# Altium project Oscilloscope_board.PrjPcb
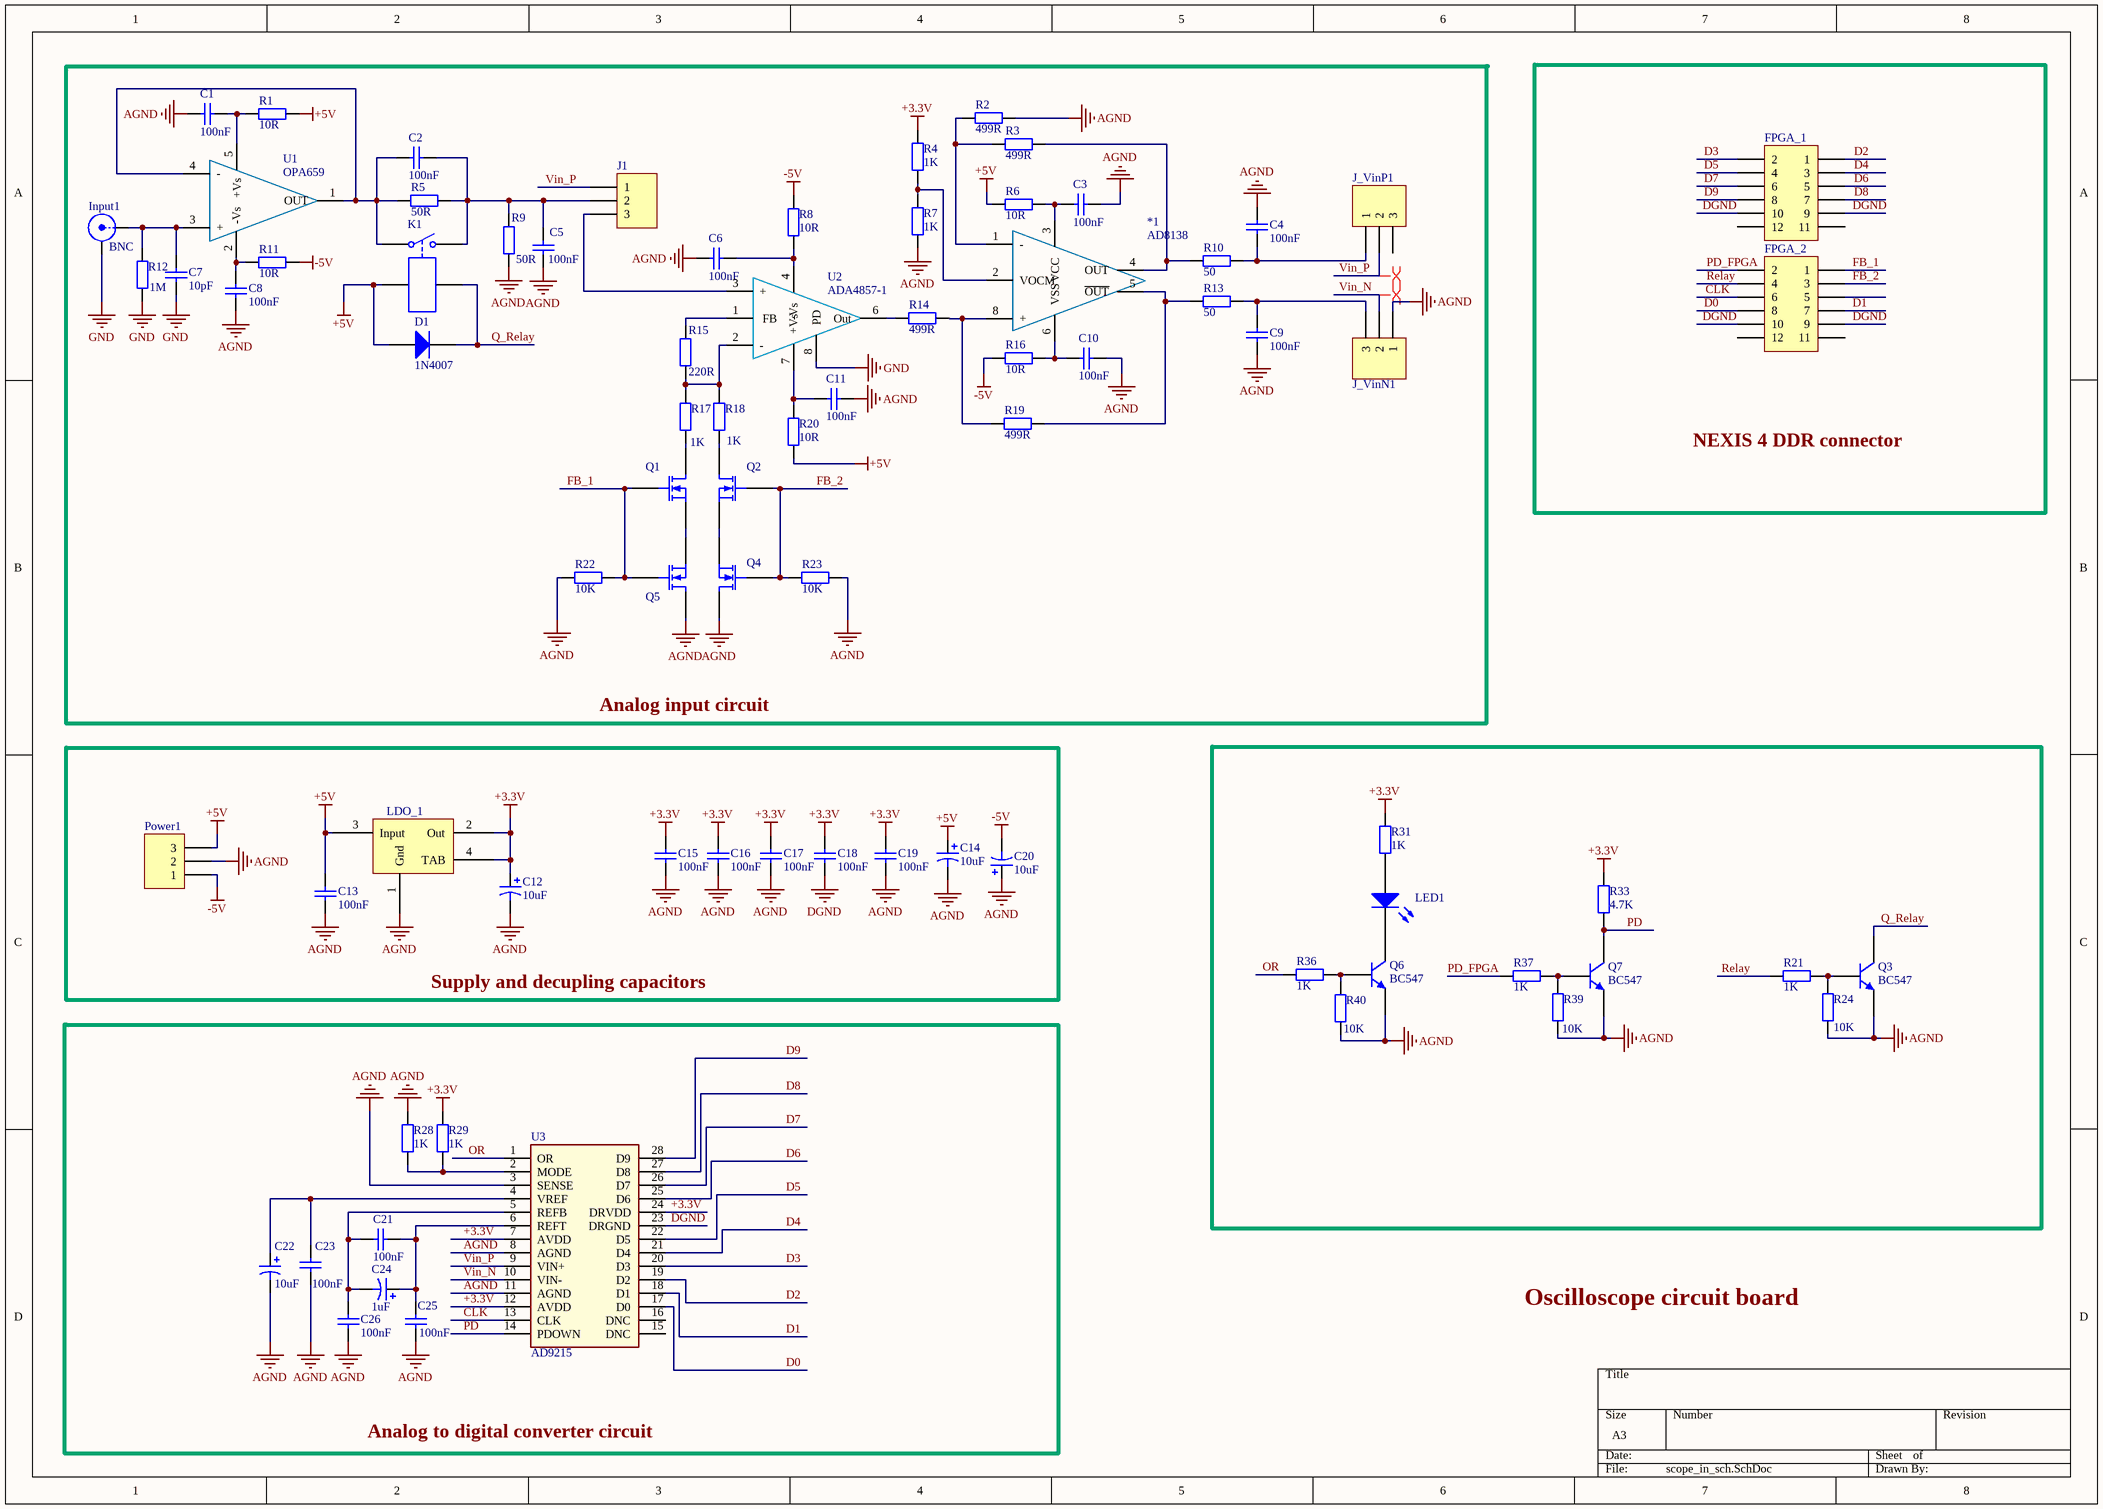
[diagram p0: scope_in_sch.SchDoc]
1 sheet, 80 parts. Net scope: global (net labels, ports and power ports of the same name join across sheets).
Board file: scope_in_pcb.PcbDoc

## Sheet scope_in_sch.SchDoc
size A3

### Parts
*1  AD8138  [SOIC 8 pini]
C1  value 100nF  [Condensator SMD(1608)]  (hidden comment: Cap)
C2  value 100nF  [Condensator SMD(1608)]  (hidden comment: Cap)
C3  value 100nF  [Condensator SMD(1608)]  (hidden comment: Cap)
C4  value 100nF  [Condensator SMD(1608)]  (hidden comment: Cap)
C5  value 100nF  [Condensator SMD(1608)]  (hidden comment: Cap)
C6  value 100nF  [Condensator SMD(1608)]  (hidden comment: Cap)
C7  value 10pF  [Condensator SMD(1608)]  (hidden comment: Cap)
C8  value 100nF  [Condensator SMD(1608)]  (hidden comment: Cap)
C9  value 100nF  [Condensator SMD(1608)]  (hidden comment: Cap)
C10  value 100nF  [Condensator SMD(1608)]  (hidden comment: Cap)
C11  value 100nF  [Condensator SMD(1608)]  (hidden comment: Cap)
C12  value 10uF  [case A]  (hidden comment: Cap Pol1)
C13  value 100nF  [Condensator SMD(1608)]  (hidden comment: Cap)
C14  value 10uF  [case A]  (hidden comment: Cap Pol1)
C15  value 100nF  [Condensator SMD(1608)]  (hidden comment: Cap)
C16  value 100nF  [Condensator SMD(1608)]  (hidden comment: Cap)
C17  value 100nF  [Condensator SMD(1608)]  (hidden comment: Cap)
C18  value 100nF  [Condensator SMD(1608)]  (hidden comment: Cap)
C19  value 100nF  [Condensator SMD(1608)]  (hidden comment: Cap)
C20  value 10uF  [case A]  (hidden comment: Cap Pol1)
C21  value 100nF  [Condensator SMD(1608)]  (hidden comment: Cap)
C22  value 10uF  [case A]  (hidden comment: Cap Pol1)
C23  value 100nF  [Condensator SMD(1608)]  (hidden comment: Cap)
C24  value 1uF  [case A]  (hidden comment: Cap Pol1)
C25  value 100nF  [Condensator SMD(1608)]  (hidden comment: Cap)
C26  value 100nF  [Condensator SMD(1608)]  (hidden comment: Cap)
D1  1N4007  [diodaSMD]
FPGA_1  Header 6X2H  [HDR2X6H]  (value not drawn)
FPGA_2  Header 6X2H  [HDR2X6H]  (value not drawn)
Input1  BNC  [BNC CONNECTOR]
J1  Header 3  [hdr3]  (value not drawn)
J_VinN1  Header 3  [hdr3]  (value not drawn)
J_VinP1  Header 3  [hdr3]  (value not drawn)
K1  Relay-SPST  [Signal_relay_5VDC]  (value not drawn)
LDO_1  Component_1  [TO-252[me]]  (value not drawn)
LED1  LED1  [led smd verde]  (value not drawn)
Power1  Header 3H  [3pin_header_90]  (value not drawn)
Q1  MOSFET-N  [SOT23-3L]  (value not drawn)
Q2  MOSFET-N  [SOT23-3L]  (value not drawn)
Q3  BC547  [SOT23-3L]
Q4  MOSFET-N  [SOT23-3L]  (value not drawn)
Q5  MOSFET-N  [SOT23-3L]  (value not drawn)
Q6  BC547  [SOT23-3L]
Q7  BC547  [SOT23-3L]
R1  value 10R  [RezistorSMD (1608)]  (hidden comment: Res2)
R2  value 499R  [RezistorSMD (1608)]  (hidden comment: Res2)
R3  value 499R  [RezistorSMD (1608)]  (hidden comment: Res2)
R4  value 1K  [RezistorSMD (1608)]  (hidden comment: Res2)
R5  value 50R  [RezistorSMD (1608)]  (hidden comment: Res2)
R6  value 10R  [RezistorSMD (1608)]  (hidden comment: Res2)
R7  value 1K  [RezistorSMD (1608)]  (hidden comment: Res2)
R8  value 10R  [RezistorSMD (1608)]  (hidden comment: Res2)
R9  value 50R  [RezistorSMD (1608)]  (hidden comment: Res2)
R10  value 50  [RezistorSMD (1608)]  (hidden comment: Res2)
R11  value 10R  [RezistorSMD (1608)]  (hidden comment: Res2)
R12  value 1M  [RezistorSMD (1608)]  (hidden comment: Res2)
R13  value 50  [RezistorSMD (1608)]  (hidden comment: Res2)
R14  value 499R  [RezistorSMD (1608)]  (hidden comment: Res2)
R15  value 220R  [RezistorSMD (1608)]  (hidden comment: Res2)
R16  value 10R  [RezistorSMD (1608)]  (hidden comment: Res2)
R17  value 1K  [RezistorSMD (1608)]  (hidden comment: Res2)
R18  value 1K  [RezistorSMD (1608)]  (hidden comment: Res2)
R19  value 499R  [RezistorSMD (1608)]  (hidden comment: Res2)
R20  value 10R  [RezistorSMD (1608)]  (hidden comment: Res2)
R21  value 1K  [RezistorSMD (1608)]  (hidden comment: Res2)
R22  value 10K  [RezistorSMD (1608)]  (hidden comment: Res2)
R23  value 10K  [RezistorSMD (1608)]  (hidden comment: Res2)
R24  value 10K  [RezistorSMD (1608)]  (hidden comment: Res2)
R28  value 1K  [RezistorSMD (1608)]  (hidden comment: Res2)
R29  value 1K  [RezistorSMD (1608)]  (hidden comment: Res2)
R31  value 1K  [RezistorSMD (1608)]  (hidden comment: Res2)
R33  value 4.7K  [RezistorSMD (1608)]  (hidden comment: Res2)
R36  value 1K  [RezistorSMD (1608)]  (hidden comment: Res2)
R37  value 1K  [RezistorSMD (1608)]  (hidden comment: Res2)
R39  value 10K  [RezistorSMD (1608)]  (hidden comment: Res2)
R40  value 10K  [RezistorSMD (1608)]  (hidden comment: Res2)
U1  OPA659  [SOT23-5_L]
U2  ADA4857-1  [SOIC 8 pini]
U3  AD9215  [TSSOP28_L]

### Blocks framed on the sheet
Analog input circuit: *1 C1-C11 D1 Input1 J1 J_VinN1 J_VinP1 K1 Q1 Q2 Q4 Q5 R1-R20 R22 R23 U1 U2
NEXIS 4 DDR connector: FPGA_1 FPGA_2
Supply and decupling capacitors: C12-C20 LDO_1 Power1
Analog to digital converter circuit: C21-C26 R28 R29 U3

### Nets
+3.3V: C12.1 C15.2 C16.2 C17.2 C18.2 C19.2 LDO_1.2(Out) LDO_1.4(TAB) R4.2 R29.2 R31.2 R33.1 U3.7(AVDD) U3.12(AVDD) U3.24(DRVDD)
+5V: C13.2 C14.1 D1.1(A) K1.2 LDO_1.3(Input) Power1.3 R1.2 R6.1 R20.1
-5V: C20.2 Power1.1 R8.2 R11.2 R16.2
AGND: C1.2 C3.1 C4.2 C5.1 C6.1 C8.1 C9.1 C10.1 C11.1 C12.2 C13.1 C14.2 C15.1 C16.1 C17.1 C19.1 C20.1 C22.2 C23.1 C25.2 C26.2 J_VinN1.1 LDO_1.1(Gnd) Power1.2 Q3.2(E) Q4.3(D) Q5.3(D) Q6.2(E) Q7.2(E) R2.2 R7.2 R9.1 R22.2 R23.1 R24.2 R28.2 R39.2 R40.1 U3.3(SENSE) U3.8(AGND) U3.11(AGND)
DGND: C18.1 FPGA_1.9 FPGA_1.10 FPGA_2.9 FPGA_2.10 U3.23(DRGND)
GND: C7.1 Input1.2(Y) R12.1 U2.8(PD)
CLK: FPGA_2.6 U3.13(CLK)
D0: FPGA_2.8 U3.17(D0)
D1: FPGA_2.7 U3.18(D1)
D2: FPGA_1.1 U3.19(D2)
D3: FPGA_1.2 U3.20(D3)
D4: FPGA_1.3 U3.21(D4)
D5: FPGA_1.4 U3.22(D5)
D6: FPGA_1.5 U3.25(D6)
D7: FPGA_1.6 U3.26(D7)
D8: FPGA_1.7 U3.27(D8)
D9: FPGA_1.8 U3.28(D9)
FB_1: FPGA_2.1 Q1.1(G) Q5.1(G) R22.1
FB_2: FPGA_2.3 Q2.1(G) Q4.1(G) R23.2
OR: R36.1 U3.1(OR)
PD: Q7.3(C) R33.2 U3.14(PDOWN)
PD_FPGA: FPGA_2.2 R37.1
Q_Relay: D1.2(K) K1.1 Q3.3(C)
Relay: FPGA_2.4 R21.1
Vin_N: J_VinN1.2 U3.10(VIN-)
Vin_P: J1.1 J_VinP1.2 U3.9(VIN+)
Net*1_1: *1.1(-) R2.1 R3.2
Net*1_2: *1.2(VOCM) R4.1 R7.1
Net*1_3: *1.3(VCC) C3.2 R6.2
Net*1_4: *1.4(OUT) R3.1 R10.2
Net*1_5: *1.5(~{OUT}) R13.2 R19.2
Net*1_6: *1.6(VSS) C10.2 R16.1
Net*1_8: *1.8(+) R14.2 R19.1
NetC1_1: C1.1 R1.1 U1.5(+Vs)
NetC2_1: C2.1 C5.2 J1.2 K1.3 R5.1 R9.2
NetC2_2: C2.2 K1.4 R5.2 U1.1(OUT) U1.4(-)
NetC4_1: C4.1 J_VinP1.1 R10.1
NetC6_2: C6.2 R8.1 U2.4(-Vs)
NetC7_2: C7.2 Input1.1(X) R12.2 U1.3(+)
NetC8_2: C8.2 R11.1 U1.2(-Vs)
NetC9_2: C9.2 J_VinN1.3 R13.1
NetC11_2: C11.2 R20.2 U2.7(+Vs)
NetC21_1: C21.1 C24.1 C25.1 U3.6(REFT)
NetC21_2: C21.2 C24.2 C26.1 U3.5(REFB)
NetC22_1: C22.1 C23.2 U3.4(VREF)
NetJ1_3: J1.3 U2.3(+)
NetLED1_1: LED1.1(A) R31.1
NetLED1_2: LED1.2(K) Q6.3(C)
NetQ1_2: Q1.2(S) Q5.2(S)
NetQ1_3: Q1.3(D) R17.1
NetQ2_2: Q2.2(S) Q4.2(S)
NetQ2_3: Q2.3(D) R18.1
NetQ3_1: Q3.1(B) R21.2 R24.1
NetQ6_1: Q6.1(B) R36.2 R40.2
NetQ7_1: Q7.1(B) R37.2 R39.1
NetR14_1: R14.1 U2.6(Out)
NetR15_1: R15.1 R17.2 R18.2 U2.2(-)
NetR15_2: R15.2 U2.1(FB)
NetR28_1: R28.1 R29.1 U3.2(MODE)

Not connected (* = marked no-connect by the designer): FPGA_1 11 12; FPGA_2 5 11 12; J_VinP1 3; U3 15(DNC) 16(DNC)

### Layout directives
differential pair: Vin_N, Vin_P

### Notes on the sheet
- Oscilloscope circuit board

### Library data of the parts
*1 = AD8138: Low Distortion,  Differential ADC Driver
C1-C11 C13 C15-C19 C21 C23 C25 C26 = Cap: Capacitor; Published: 8-Jun-2000; LatestRevisionDate: 17-Jul-2002; LatestRevisionNote: Re-released for DXP Platform.; PackageReference: RAD-0.3; Publisher: Altium Limited; PackageDescription: Radial Cap, Thru-Hole; 2 Leads; 0.3 in Pin Spacing
C12 C14 C20 C22 C24 = Cap Pol1: Polarized Capacitor (Radial); Published: 8-Jun-2000; LatestRevisionDate: 17-Jul-2002; LatestRevisionNote: Re-released for DXP Platform.; PackageReference: RB7.6-15; Publisher: Altium Limited; PackageDescription: Polarized Capacitor (Radial); 2 Leads
D1 = Diode: Default Diode; Published: 8-Jun-2000; LatestRevisionDate: 17-Jul-2002; LatestRevisionNote: Re-released for DXP Platform.; PackageVersion: Sep-1996; PackageReference: SMC; Publisher: Altium Limited; PackageDescription: DO-214-AB/SMC; 2 C-Bend Leads; Body 7.9 x 5.9 mm, inc. leads (LxW); Code_JEDEC: DO-214-AB
FPGA_1 FPGA_2 = Header 6X2H: Header, 6-Pin, Dual row, Right Angle; LatestRevisionDate: 17-Jul-2002; LatestRevisionNote: Re-released for DXP Platform.; Publisher: Altium Limited
Input1 = BNC: BNC Elbow Connector; LatestRevisionDate: 17-Jul-2002; LatestRevisionNote: Re-released for DXP Platform.; Publisher: Altium Limited
J1 J_VinN1 J_VinP1 = Header 3: Header, 3-Pin; LatestRevisionDate: 17-Jul-2002; LatestRevisionNote: Re-released for DXP Platform.; Publisher: Altium Limited
K1 = Relay-SPST: Single-Pole Single-Throw Relay; Published: 24-Mar-1999; LatestRevisionDate: 17-Jul-2002; LatestRevisionNote: Re-released for DXP Platform.; PackageReference: MODULE4; Publisher: Altium Limited
LED1 = LED1: Typical RED GaAs LED; Published: 8-Jun-2000; LatestRevisionDate: 08-Jul-2005; LatestRevisionNote: Mech Layer 1 removed.; PackageReference: LED-1; Publisher: Altium Limited; PackageDescription: LED; 2 Leads
Power1 = Header 3H: Header, 3-Pin, Right Angle; LatestRevisionDate: 17-Jul-2002; LatestRevisionNote: Re-released for DXP Platform.; Publisher: Altium Limited
Q1 Q2 Q4 Q5 = MOSFET-N: N-Channel MOSFET; Published: 8-Jun-2000; LatestRevisionDate: 17-Jul-2002; LatestRevisionNote: Re-released for DXP Platform.; PackageVersion: 1995/1996; PackageReference: E3; Publisher: Altium Limited; PackageDescription: TO, Flat Index; 3 In-Line, Axial Leads; Body Dia. 4.6mm; Lead Dia. 0.5 mm (max)
Q3 Q6 Q7 = QNPN: NPN Bipolar Transistor; Published: 8-Jun-2000; LatestRevisionDate: 29-May-2009; LatestRevisionNote: IPC-7351 Footprint Added.; PackageVersion: Aug-1999; PackageReference: SOT-23B; Publisher: Altium Limited; PackageDescription: 3-Pin SOT-23 Package 0.95 mm Pitch, 2.4 mm Lead Span
R1-R24 R28 R29 R31 R33 R36 R37 R39 R40 = Res2: Resistor; Published: 8-Jun-2000; LatestRevisionDate: 17-Jul-2002; LatestRevisionNote: Re-released for DXP Platform.; PackageReference: AXIAL-0.4; Publisher: Altium Limited; PackageDescription: Axial Device, Thru-Hole; 2 Leads; 0.4 in Pin Spacing
U1 = OPA659: Wideband, Unity-Gain Stable, JFET-Input  Operational Amplifier
U2 = ADA4857-1: Ultralow Distortion, Low Power,  Low Noise, High Speed Op Amp
U3 = AD9215: 10-Bit, 65/80/105 MSPS,  3 V A/D Converter